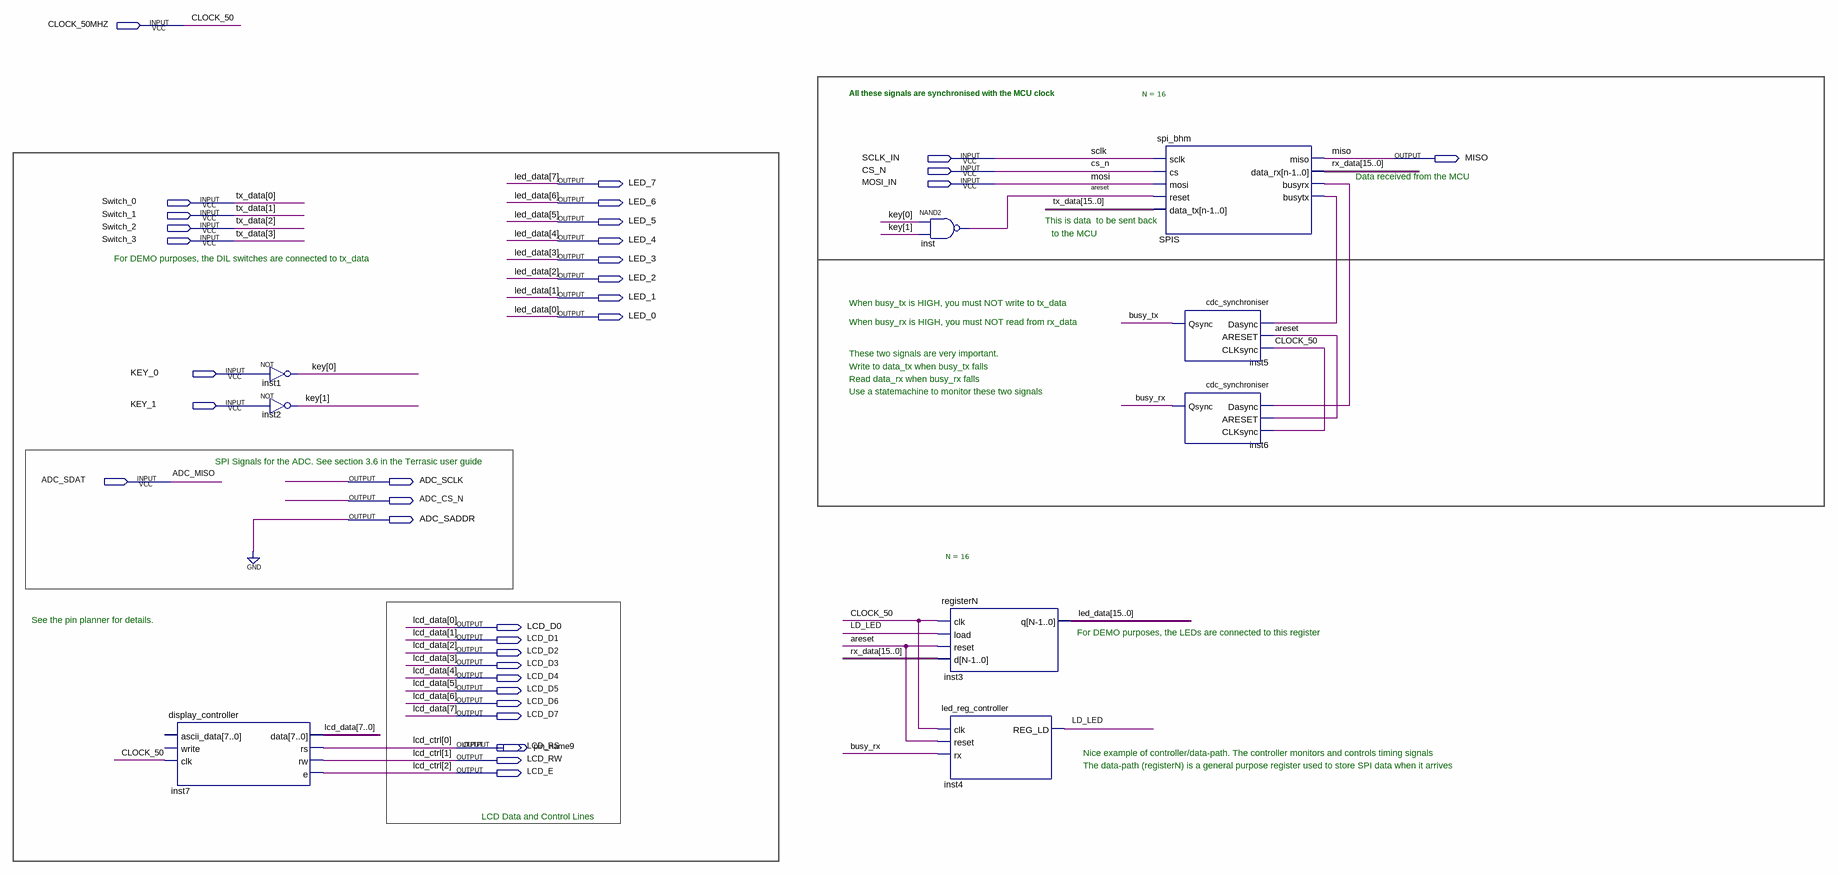
[diagram p0: schematic sheet]
// Quartus schematic spi_test.bdf as structural Verilog: 9 symbols, 35 pins
module spi_test (
  input  CLOCK_50MHZ,
  input  SCLK_IN,
  input  CS_N,
  input  MOSI_IN,
  input  Switch_0,
  input  Switch_1,
  input  Switch_2,
  input  Switch_3,
  input  KEY_0,
  input  KEY_1,
  input  ADC_SDAT,
  output MISO,
  output LED_7,
  output LED_6,
  output LED_5,
  output LED_4,
  output LED_3,
  output LED_2,
  output LED_1,
  output LED_0,
  output ADC_SCLK,
  output ADC_CS_N,
  output ADC_SADDR,
  output LCD_D0,
  output LCD_D1,
  output LCD_D2,
  output LCD_D3,
  output LCD_D4,
  output LCD_D5,
  output LCD_D6,
  output LCD_D7,
  output LCD_RS,
  output pin_name9,
  output LCD_RW,
  output LCD_E
);

  wire areset, busy_rx, busy_tx, LD_LED, SPIS_busyrx, SPIS_busytx;
  wire [1:0] key;
  wire [15:0] rx_data;
  wire [15:4] tx_data;
  wire [15:8] led_data;

  display_controller inst7 (
    .clk(CLOCK_50MHZ), .data({LCD_D7, LCD_D6, LCD_D5, LCD_D4, LCD_D3, LCD_D2, LCD_D1, LCD_D0}), .rs(LCD_RS),
    .rw(LCD_RW), .e(LCD_E));  // open: ascii_data, write
  not inst1 (key[0], KEY_0);
  not inst2 (key[1], KEY_1);
  nand inst (areset, key[0], key[1]);
  registerN #(.N(16)) inst3 (
    .clk(CLOCK_50MHZ), .load(LD_LED), .reset(areset), .d(rx_data),
    .q({led_data, LED_7, LED_6, LED_5, LED_4, LED_3, LED_2, LED_1, LED_0}));
  led_reg_controller inst4 (.clk(CLOCK_50MHZ), .reset(areset), .rx(busy_rx), .REG_LD(LD_LED));
  spi_bhm #(.N(16)) SPIS (
    .sclk(SCLK_IN), .cs(CS_N), .mosi(MOSI_IN), .reset(areset),
    .data_tx({tx_data, Switch_3, Switch_2, Switch_1, Switch_0}), .miso(MISO), .data_rx(rx_data),
    .busyrx(SPIS_busyrx), .busytx(SPIS_busytx));
  cdc_synchroniser inst5 (.Dasync(SPIS_busytx), .ARESET(areset), .CLKsync(CLOCK_50MHZ), .Qsync(busy_tx));
  cdc_synchroniser inst6 (.Dasync(SPIS_busyrx), .ARESET(areset), .CLKsync(CLOCK_50MHZ), .Qsync(busy_rx));

  assign ADC_SADDR = 1'b0;

  // Other names for the same wires on the sheet: ADC_MISO = ADC_SDAT; CLOCK_50 = CLOCK_50MHZ;
  //   lcd_ctrl[2:0] = {LCD_E, LCD_RW, LCD_RS};
  //   lcd_data[7:0] = {LCD_D7, LCD_D6, LCD_D5, LCD_D4, LCD_D3, LCD_D2, LCD_D1, LCD_D0};
  //   led_data[7:0] = {LED_7, LED_6, LED_5, LED_4, LED_3, LED_2, LED_1, LED_0}; mosi = MOSI_IN; sclk = SCLK_IN;
  //   tx_data[3:0] = {Switch_3, Switch_2, Switch_1, Switch_0}

  // Notes on the sheet:
  //   All these signals are synchronised with the MCU clock
  //   Data received from the MCU
  //   This is data  to be sent back
  //   to the MCU
  //   For DEMO purposes, the DIL switches are connected to tx_data
  //   When busy_tx is HIGH, you must NOT write to tx_data
  //   When busy_rx is HIGH, you must NOT read from rx_data
  //   These two signals are very important.
  //   Write to data_tx when busy_tx falls
  //   Read data_rx when busy_rx falls
  //   Use a statemachine to monitor these two signals
  //   SPI Signals for the ADC. See section 3.6 in the Terrasic user guide
  //   See the pin planner for details.
  //   For DEMO purposes, the LEDs are connected to this register
  //   Nice example of controller/data-path. The controller monitors and controls timing signals
  //   The data-path (registerN) is a general purpose register used to store SPI data when it arrives
  //   LCD Data and Control Lines
endmodule
